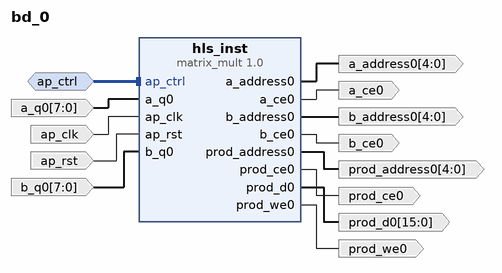
[diagram p0: block diagram of the top level]
# Vivado block design bd_0, xc7z020clg484-1, Vivado 2022.2
create_bd_design bd_0

create_bd_intf_port -mode Slave -vlnv xilinx.com:interface:acc_handshake_rtl:1.0 ap_ctrl
create_bd_port -dir O -from 4 -to 0 -type data a_address0
create_bd_port -dir O a_ce0
create_bd_port -dir I -from 7 -to 0 -type data a_q0
create_bd_port -dir I -type clk ap_clk
set_property -dict {CONFIG.FREQ_HZ 200000000.0} [get_bd_ports ap_clk]
create_bd_port -dir I -type rst ap_rst
set_property -dict {CONFIG.POLARITY ACTIVE_HIGH} [get_bd_ports ap_rst]
create_bd_port -dir O -from 4 -to 0 -type data b_address0
create_bd_port -dir O b_ce0
create_bd_port -dir I -from 7 -to 0 -type data b_q0
create_bd_port -dir O -from 4 -to 0 -type data prod_address0
create_bd_port -dir O prod_ce0
create_bd_port -dir O -from 15 -to 0 -type data prod_d0
create_bd_port -dir O prod_we0

create_bd_cell -type ip -vlnv xilinx.com:hls:matrix_mult:1.0 hls_inst

# ---- connections ----

connect_bd_intf_net -intf_net ap_ctrl_0_1 [get_bd_intf_ports ap_ctrl] [get_bd_intf_pins hls_inst/ap_ctrl]
connect_bd_net -net a_q0_0_1 [get_bd_ports a_q0] [get_bd_pins hls_inst/a_q0]
connect_bd_net -net ap_clk_0_1 [get_bd_ports ap_clk] [get_bd_pins hls_inst/ap_clk]
connect_bd_net -net ap_rst_0_1 [get_bd_ports ap_rst] [get_bd_pins hls_inst/ap_rst]
connect_bd_net -net b_q0_0_1 [get_bd_ports b_q0] [get_bd_pins hls_inst/b_q0]
connect_bd_net [get_bd_pins hls_inst/a_address0] [get_bd_ports a_address0]
connect_bd_net [get_bd_pins hls_inst/a_ce0] [get_bd_ports a_ce0]
connect_bd_net [get_bd_pins hls_inst/b_address0] [get_bd_ports b_address0]
connect_bd_net [get_bd_pins hls_inst/b_ce0] [get_bd_ports b_ce0]
connect_bd_net [get_bd_pins hls_inst/prod_address0] [get_bd_ports prod_address0]
connect_bd_net [get_bd_pins hls_inst/prod_ce0] [get_bd_ports prod_ce0]
connect_bd_net [get_bd_pins hls_inst/prod_d0] [get_bd_ports prod_d0]
connect_bd_net [get_bd_pins hls_inst/prod_we0] [get_bd_ports prod_we0]

validate_bd_design
save_bd_design
